# EAGLE design pcb_inverter_final (EAGLE 6.6.0)
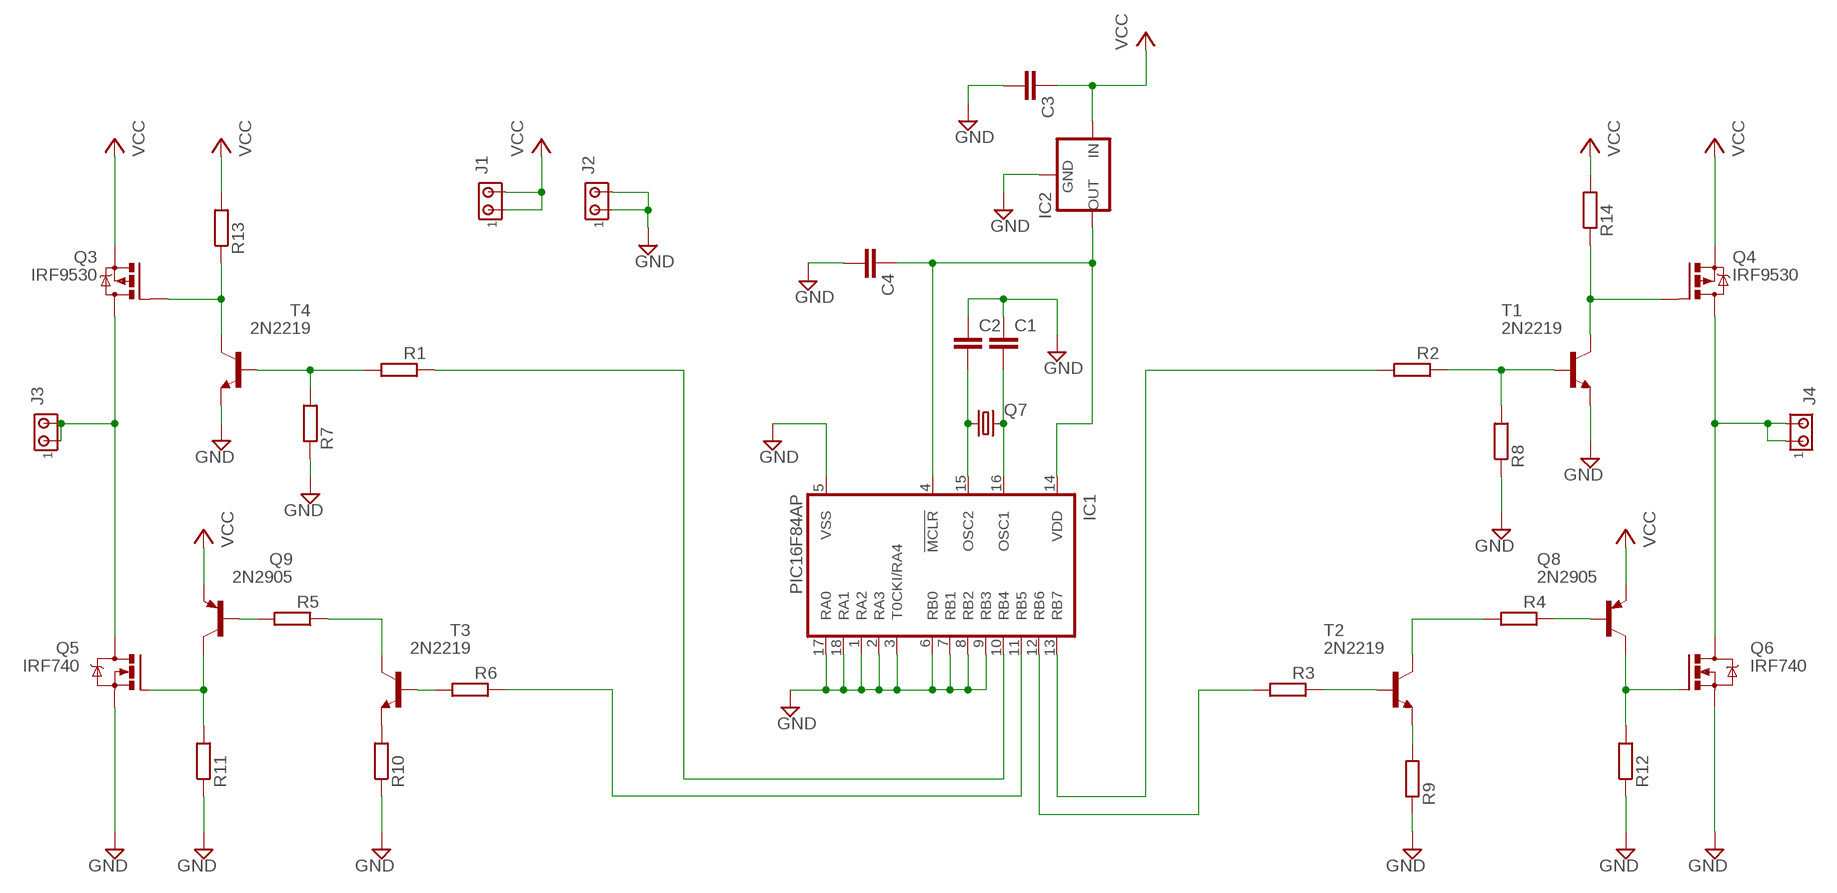
[diagram p0: schematic, sheet 1]

## Parts
C1  C2.5/5  [C2.5-5]
C2  C2.5/5  [C2.5-5]
C3  C2.5/5  [C2.5-5]
C4  C2.5/5  [C2.5-5]
IC1  PIC16F84AP  [DIL18]
IC2  78XXS  [78XXS]
J1  MTA02-156  [1X2MTA]
J2  MTA02-156  [1X2MTA]
J3  MTA02-156  [1X2MTA]
J4  MTA02-156  [1X2MTA]
Q3  IRF9530  [TO220BV]
Q4  IRF9530  [TO220BV]
Q5  IRF740  [TO220BV]
Q6  IRF740  [TO220BV]
Q7  CRYSTALHC18U-V  [HC18U-V]
Q8  2N2905  [TO5]
Q9  2N2905  [TO5]
R1  R-EU_0204/7  [0204/7]
R2  R-EU_0204/7  [0204/7]
R3  R-EU_0204/7  [0204/7]
R4  R-EU_0204/7  [0204/7]
R5  R-EU_0204/7  [0204/7]
R6  R-EU_0204/7  [0204/7]
R7  R-EU_0204/7  [0204/7]
R8  R-EU_0204/7  [0204/7]
R9  R-EU_0204/7  [0204/7]
R10  R-EU_0204/7  [0204/7]
R11  R-EU_0204/7  [0204/7]
R12  R-EU_0204/7  [0204/7]
R13  R-EU_0204/7  [0204/7]
R14  R-EU_0204/7  [0204/7]
T1  2N2219  [TO5]
T2  2N2219  [TO5]
T3  2N2219  [TO5]
T4  2N2219  [TO5]

## Nets
GND: C1.1 C2.1 C3.2 C4.2 IC1.1(RA2) IC1.2(RA3) IC1.3(T0CKI/RA4) IC1.5(VSS) IC1.6(RB0) IC1.7(RB1) IC1.8(RB2) IC1.9(RB3) IC1.17(RA0) IC1.18(RA1) IC2.GND J2.1 J2.2 Q5.S Q6.S R7.1 R8.1 R9.1 R10.1 R11.1 R12.1 T1.1(E) T4.1(E)
N$1: Q3.G R13.1 T4.3(C)
N$2: R1.2 R7.2 T4.2(B)
N$3: J3.1 J3.2 Q3.D Q5.D
N$4: Q6.G Q8.3(C) R12.2
N$5: Q5.G Q9.3(C) R11.2
N$6: Q9.2(B) R5.2
N$7: R5.1 T3.3(C)
N$8: R10.2 T3.1(E)
N$9: R6.2 T3.2(B)
N$10: IC1.11(RB5) R6.1
N$11: Q8.2(B) R4.1
N$12: R4.2 T2.3(C)
N$13: R9.2 T2.1(E)
N$14: R3.1 T2.2(B)
N$15: IC1.10(RB4) R1.1
N$16: J4.1 J4.2 Q4.D Q6.D
N$17: Q4.G R14.1 T1.3(C)
N$18: R2.1 R8.2 T1.2(B)
N$19: C2.2 IC1.15(OSC2) Q7.1
N$21: C1.2 IC1.16(OSC1) Q7.2
N$24: IC1.12(RB6) R3.2
N$25: IC1.13(RB7) R2.2
N$26: C4.1 IC1.4(!MCLR) IC1.14(VDD) IC2.OUT
VCC: C3.1 IC2.IN J1.1 J1.2 Q3.S Q4.S Q8.1(E) Q9.1(E) R13.2 R14.2

## Library data of the parts
C1-C4 = capacitor-wima:C: CAPACITOR naming: grid - package width
IC1 = microchip:PIC16F8*: MICROCONTROLLER 8-Bit PIC16F8X Family - CMOS Flash/EEPROM Pin Compatible : PIC16F83, PIC16CR83, PIC16F84A, PIC16CR84 see also PIC16C* <DEVICE:PIC16C*>; MF: MICROCHIP; MPN: PIC16F84A-04I/P; OC_FARNELL: 9760865; OC_NEWARK: 69K7635
IC2 = v-reg:78XXS: VOLTAGE REGULATOR
J1-J4 = con-amp:MTA02-156: AMP connector
Q3 Q4 = transistor-power:IRF9530: P-CHANNEL HEXFET POWER-MOS-FET Source: http://www.irf.com/product-info/datasheets/data/irf9530.pdf
Q5 Q6 = transistor-power:IRF740: N-CHANNEL MOS FET
Q7 = crystal:CRYSTAL: CRYSTAL; OC_FARNELL: unknown; OC_NEWARK: unknown
Q8 Q9 = transistor-pnp:2N2905: PNP Transistor
R1-R14 = rcl:R-EU_: RESISTOR, European symbol
T1-T4 = transistor:2N2219: NPN TRANSISTOR

## Board
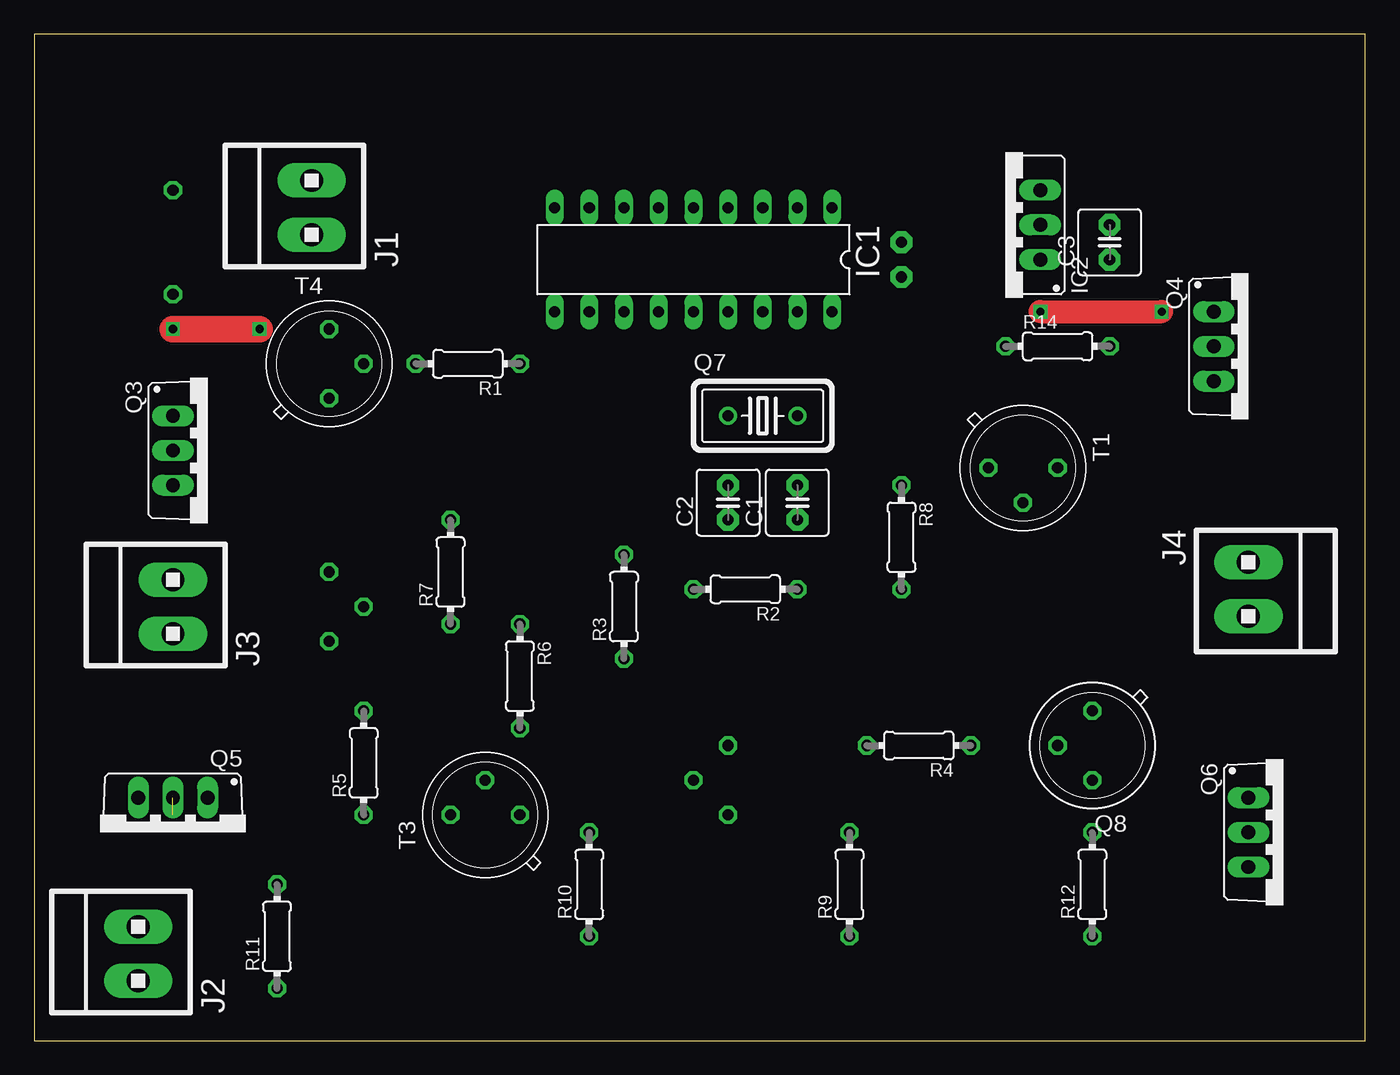
[diagram p1: board, top side]
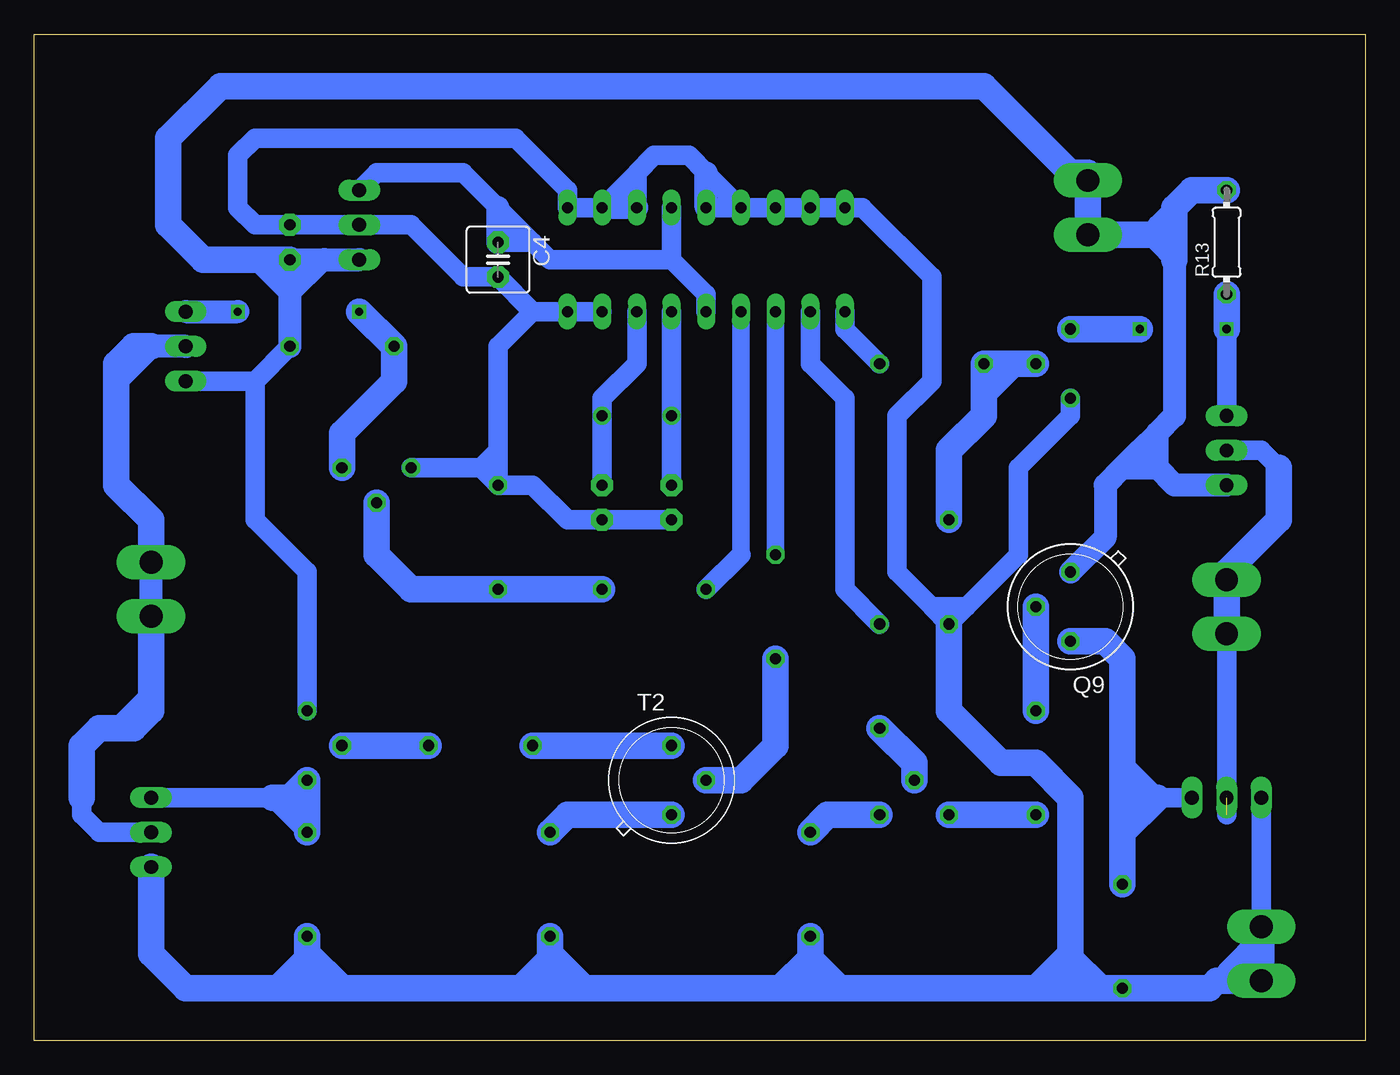
[diagram p2: board, bottom side, seen from below]

Size 97.46 x 73.65 mm. Coordinates in mm from the lower left corner, seen from the top.
Outline: 0,0 97.46,0 97.46,73.65 0,73.65 0,0
Copper layers (1*16): Top 0.035mm / dielectric 1.5mm / Bottom 0.035mm
Design rules "default": minimum track width 10mil, minimum drill 24mil, track to track 8mil, track to pad 8mil, pad to pad 8mil, via to via 8mil, smd to smd 8mil, copper to edge 40mil, drill to drill 8mil, minimum pad ring 10mil, minimum via ring 8mil, stop-mask expansion 4mil, vias tented up to drill 0mil, thermal gap 10mil

### Footprints (pad centres in the part's own frame; a part is rotated, then mirrored left to right if it is on the bottom)
C2.5-5 = drill 0.813 pad 1.6 octagon: 1 -1.27,0; 2 1.27,0
DIL18 = drill 0.813 long: 1 -10.16,-3.81; 2 -7.62,-3.81; 3 -5.08,-3.81; 4 -2.54,-3.81; 5 0,-3.81; 6 2.54,-3.81; 7 5.08,-3.81; 8 7.62,-3.81; 9 10.16,-3.81; 10 10.16,3.81; 11 7.62,3.81; 12 5.08,3.81; 13 2.54,3.81; 14 0,3.81; 15 -2.54,3.81; 16 -5.08,3.81; 17 -7.62,3.81; 18 -10.16,3.81
78XXS = drill 1.016 long: GND 0,-2.54; IN -2.54,-2.54; OUT 2.54,-2.54
1X2MTA = drill 1.676 long: 1 1.981,0; 2 -1.981,0
TO220BV = drill 1.016 long: D 0,-2.54; G -2.54,-2.54; S 2.54,-2.54
HC18U-V = drill 0.813: 1 -2.54,0; 2 2.54,0
TO5 = drill 0.813 octagon: 1 0,-2.54; 2 2.54,0; 3 0,2.54
0204/7 = drill 0.813 octagon: 1 -3.81,0; 2 3.81,0

### Placement (x,y rotation side)
C1  55.88,39.37 90 top
C2  50.8,39.37 90 top
C3  78.74,58.42 90 top
C4  63.5,57.15 270 bottom
IC1  48.26,57.15 180 top
IC2  71.12,59.69 90 top
J1  20.32,60.96 90 top
J2  7.62,6.35 90 top
J3  10.16,31.75 90 top
J4  88.9,33.02 270 top
Q3  12.7,43.18 270 top
Q4  88.9,50.8 270 top
Q5  10.16,15.24 180 top
Q6  91.44,15.24 270 top
Q7  53.34,45.72 0 top
Q8  77.47,21.59 180 top
Q9  21.59,31.75 180 bottom
R1  31.75,49.53 180 top
R2  52.07,33.02 180 top
R3  43.18,31.75 90 top
R4  64.77,21.59 180 top
R5  24.13,20.32 90 top
R6  35.56,26.67 270 top
R7  30.48,34.29 90 top
R8  63.5,36.83 270 top
R9  59.69,11.43 90 top
R10  40.64,11.43 90 top
R11  17.78,7.62 90 top
R12  77.47,11.43 90 top
R13  10.16,58.42 90 bottom
R14  74.93,50.8 0 top
T1  72.39,41.91 270 top
T2  50.8,19.05 0 bottom
T3  33.02,16.51 90 top
T4  21.59,49.53 0 top

### Tracks (layer width: path | path; a pad name or v marks a point on that pad's centre or on a via)
GND
  Bottom 1.422: 10.16,5.08 7.62,7.62 7.62,6.35 8.89,5.08 | 21.59,6.35 19.05,3.81 20.32,3.81 21.59,5.08 | 43.18,3.81 40.64,6.35 38.1,3.81 | 59.69,6.35 62.23,3.81 60.96,3.81 59.69,5.08 | 77.47,6.35 80.01,3.81 78.74,3.81 77.47,5.08 | T4.1 21.59,45.72 25.4,41.91 25.4,35.56 29.21,31.75 | 29.21,31.75 R7.1 31.75,31.75 | 31.75,31.75 34.29,34.29 34.29,45.72 31.75,48.26 31.75,55.88 36.83,60.96 IC1.9 IC1.8 IC1.7 IC1.6 | IC1.6 IC1.5 | IC1.3 53.34,63.5 | 53.34,63.5 52.07,64.77 49.53,64.77 48.26,63.5 IC1.6 | 53.34,63.5 IC1.2 IC1.1 58.42,62.23 62.23,66.04 81.28,66.04 82.55,64.77 82.55,60.96 81.28,59.69 C3.2 IC2.GND 69.85,59.69 66.04,55.88 C4.2 60.96,53.34 | IC1.17 IC1.18 60.96,53.34 | R8.1 63.5,41.91 64.77,41.91 | 64.77,41.91 T1.1 | R8.1 63.5,43.18 | 60.96,53.34 63.5,50.8 63.5,43.18 | J2.1 Q5.S | 29.21,31.75 31.75,31.75 | R8.1 64.77,41.91 | 64.77,41.91 63.5,43.18 | C2.1 C1.1 58.42,38.1 60.96,40.64 R8.1
  Bottom 1.676: IC1.5 48.26,63.5 | IC1.3 IC1.2
  Bottom 1.93: J2.1 7.62,7.62 J2.2 10.87,4.37 11.43,3.81 R11.1 19.05,3.81 24.13,3.81 | 24.13,3.81 38.1,3.81 39.37,3.81 | 39.37,3.81 40.64,5.08 40.64,6.35 R10.1 | 24.13,3.81 21.59,6.35 21.59,17.78 24.13,20.32 26.67,20.32 30.48,24.13 R7.1 | R9.1 59.69,6.35 57.15,3.81 | 57.15,3.81 43.18,3.81 39.37,3.81 | R12.1 77.47,6.35 74.93,3.81 | 74.93,3.81 62.23,3.81 57.15,3.81 | Q6.S 88.9,6.35 86.36,3.81 80.01,3.81 74.93,3.81
N$1  (via drill 0.6)  (1 unrouted)
  Top 1.93: v10.16,52.07 16.51,52.07
  Bottom 1.422: Q3.G v10.16,52.07
  Bottom 1.93: v10.16,52.07 R13.1 | T4.3 16.51,52.07
N$2
  Bottom 1.422: 27.94,46.99 25.4,49.53
  Bottom 1.93: T4.2 25.4,49.53 R1.2 27.94,46.99 27.94,45.72 30.48,43.18 R7.2
N$3  (1 unrouted)
  Bottom 1.422: 6.35,41.91 7.62,43.18 Q3.D | J3.2 10.16,16.51
  Bottom 1.93: J3.2 J3.1 10.16,34.29 6.35,38.1 6.35,41.91
N$4
  Bottom 1.422: R12.2 80.01,17.78 | Q6.G 78.74,17.78
  Bottom 1.93: R12.2 Q8.3 78.74,17.78 80.01,17.78
N$5
  Bottom 1.422: 16.51,17.78 17.78,19.05 17.78,20.32 15.24,17.78 Q5.G
  Bottom 1.93: R11.2 17.78,15.24 | 17.78,15.24 15.24,17.78 | Q9.3 19.05,29.21 17.78,27.94 17.78,20.32 17.78,15.24
N$6
  Bottom 1.93: Q9.2 R5.2
N$7
  Bottom 1.93: R5.1 T3.3
N$8
  Bottom 1.93: T3.1 39.37,16.51 R10.2
N$9
  Bottom 1.93: T3.2 33.02,20.32 R6.2
N$10
  Bottom 1.422: R6.1 38.1,33.02 38.1,46.99 40.64,49.53 IC1.11
N$11
  Bottom 1.93: R4.1 Q8.2
N$12
  Bottom 1.93: T2.3 R4.2
N$13
  Bottom 1.93: R9.2 58.42,16.51 T2.1
N$14
  Bottom 1.93: T2.2 45.72,19.05 43.18,21.59 R3.1
N$15
  Bottom 1.422: IC1.10 38.1,52.07 R1.1
N$16
  Bottom 1.422: 91.44,22.86 88.9,25.4 | Q6.D 92.71,15.24 93.98,16.51 93.98,21.59
  Bottom 1.676: 91.44,48.26 88.9,50.8 Q4.D | J4.1 J4.2
  Bottom 1.93: 93.98,17.78 93.98,21.59 92.71,22.86 91.44,22.86 90.17,22.86 88.9,24.13 88.9,25.4 J4.1 | J4.2 88.9,38.1 91.44,40.64 91.44,48.26 91.44,49.53 90.17,50.8 88.9,50.8
N$17  (via drill 0.6)
  Top 1.676: v73.66,53.34 v82.55,53.34
  Bottom 1.676: Q4.G v82.55,53.34
  Bottom 1.93: T1.3 74.93,44.45 71.12,48.26 R14.1 v73.66,53.34
N$18
  Bottom 1.93: R2.1 R8.2 69.85,33.02 72.39,35.56 T1.2
N$19
  Bottom 1.422: IC1.15 Q7.1 C2.2
N$21
  Bottom 1.422: 53.34,52.07 IC1.16 53.34,49.53 55.88,46.99 Q7.2 C1.2
N$23  (via drill 0.6)
  other vias: 16.51,52.07
N$24
  Bottom 1.27: R3.2 IC1.12
N$25
  Bottom 1.27: IC1.13 45.72,35.56
  Bottom 1.422: 45.72,35.56 R2.2
N$26
  Bottom 1.422: IC1.14 48.26,54.61 50.8,57.15 | 50.8,57.15 IC1.4 | IC2.OUT 72.39,63.5 66.04,63.5 63.5,60.96 60.96,58.42 | 50.8,57.15 59.69,57.15 60.96,58.42 | C4.1 60.96,58.42
  Bottom 1.676: C4.1 63.5,60.96
VCC
  Bottom 1.422: 15.24,59.69 13.97,60.96 | 13.97,57.15 15.24,58.42 | R14.2 81.28,48.26 | 81.28,48.26 Q4.S | Q8.1 77.47,34.29 81.28,38.1 81.28,48.26 | 76.2,57.15 78.74,54.61 81.28,57.15
  Bottom 1.676: R14.2 78.74,54.61 C3.1 76.2,57.15 IC2.IN | 13.97,57.15 13.97,45.72 15.24,44.45 | 15.24,44.45 16.51,43.18 | 16.51,43.18 17.78,41.91 | 17.78,41.91 19.05,40.64 19.05,36.83 Q9.1 | Q3.S 13.97,40.64 15.24,41.91 | 15.24,41.91 16.51,43.18 | 17.78,41.91 15.24,41.91 | 15.24,41.91 15.24,44.45
  Bottom 1.93: 13.97,57.15 13.97,58.42 | 13.97,58.42 14.53,58.98 J1.2 J1.1 20.32,63.5 21.59,63.5 27.94,69.85 83.82,69.85 87.63,66.04 87.63,59.69 85.09,57.15 81.28,57.15 C3.1 | 13.97,58.42 13.97,60.96 12.7,62.23 R13.2